# EAGLE design MC33932_H-Bridge (EAGLE 8.6.3)
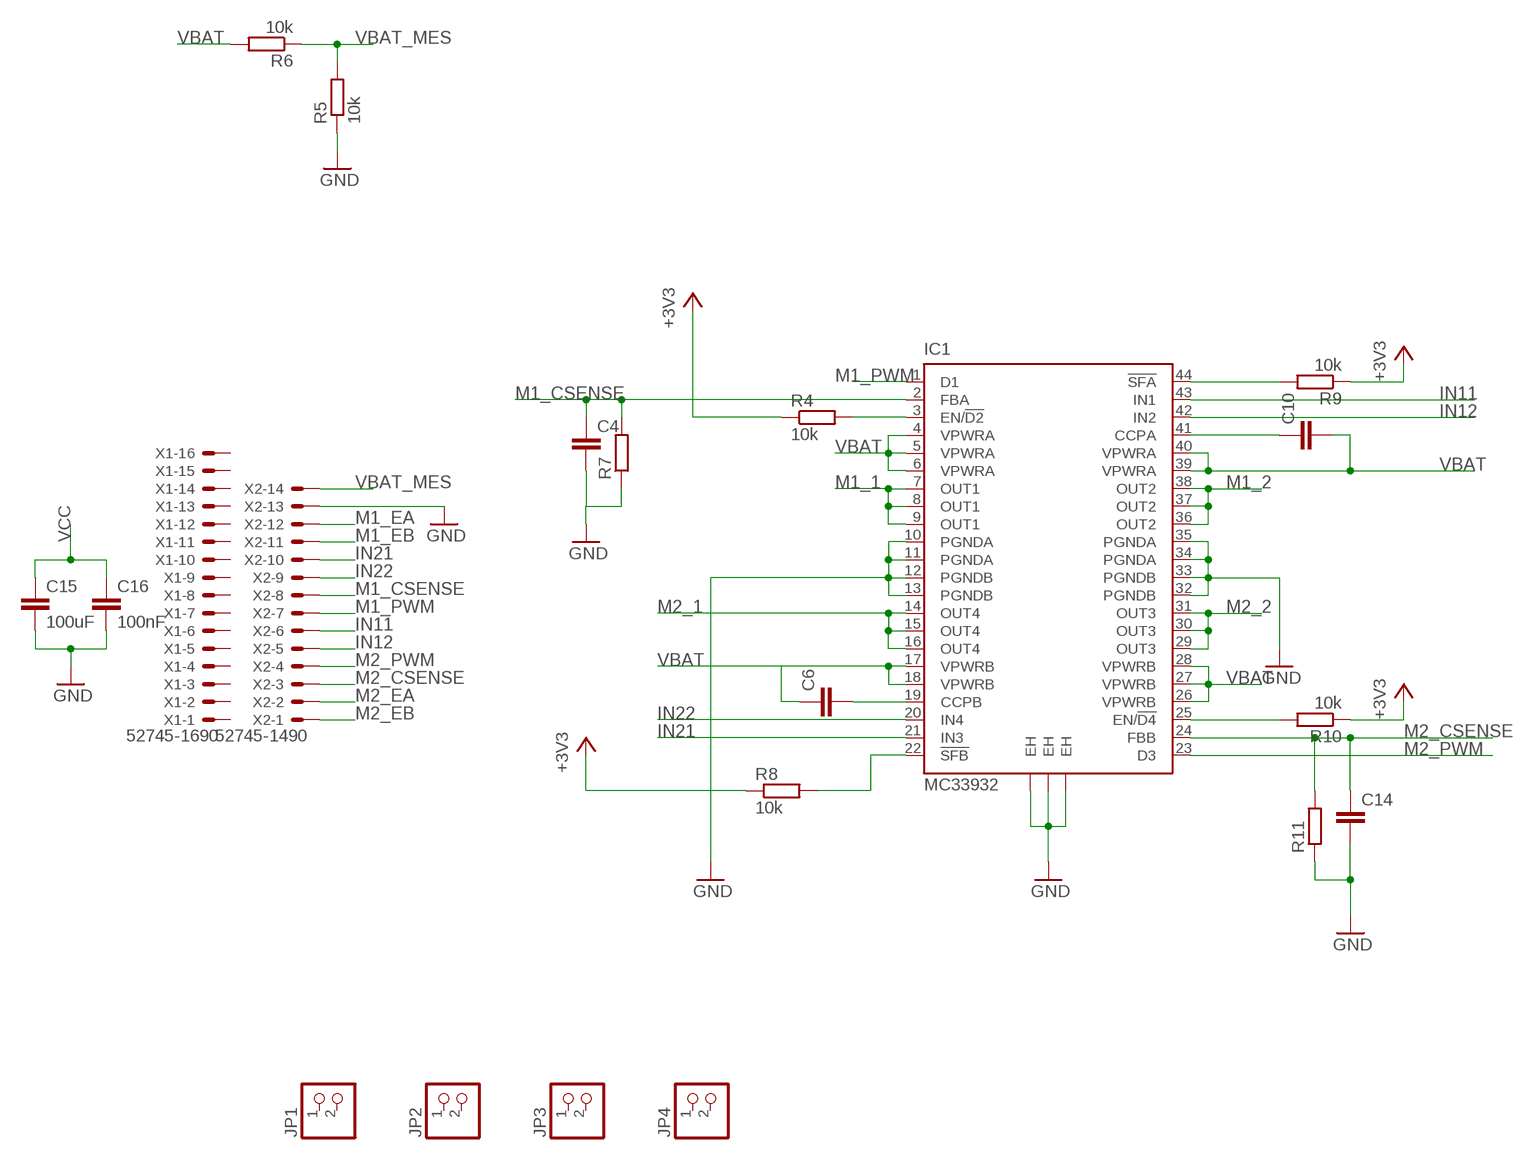
[diagram p0: schematic, sheet 1]

## Parts
C4  C-EUC0603  [C0603]
C6  C-EUC0805  [C0805]
C10  C-EUC0805  [C0805]
C14  C-EUC0603  [C0603]
C15  100uF  C-EUC1210K  [C1210K]
C16  100nF  C-EUC0603  [C0603]
IC1  MC33932  [HSOP44]
JP1  PINHD-1X2  [1X02]
JP2  PINHD-1X2  [1X02]
JP3  PINHD-1X2  [1X02]
JP4  PINHD-1X2  [1X02]
R4  10k  R-EU_R0603  [R0603]
R5  10k  R-EU_R0603  [R0603]
R6  10k  R-EU_R0603  [R0603]
R7  R-EU_R0603  [R0603]
R8  10k  R-EU_R0603  [R0603]
R9  10k  R-EU_R0603  [R0603]
R10  10k  R-EU_R0603  [R0603]
R11  R-EU_R0603  [R0603]
X1  52745-1690  [52745-1690]
X2  52745-1490  [52745-1490]

## Nets
+3V3: R4.1 R8.1 R9.1 R10.1
GND: C4.2 C14.2 C15.2 C16.2 IC1.10(PGNDA) IC1.11(PGNDA) IC1.12(PGNDB) IC1.13(PGNDB) IC1.32(PGNDB) IC1.33(PGNDB) IC1.34(PGNDA) IC1.35(PGNDA) IC1.EH@1(EH) IC1.EH@2(EH) IC1.EH@3(EH) R5.1 R7.1 R11.1 X2.13
IN11: IC1.43(IN1) X2.6
IN12: IC1.42(IN2) X2.5
IN21: IC1.21(IN3) X2.10
IN22: IC1.20(IN4) X2.9
M1_1: IC1.7(OUT1) IC1.8(OUT1) IC1.9(OUT1)
M1_2: IC1.36(OUT2) IC1.37(OUT2) IC1.38(OUT2)
M1_CSENSE: C4.1 IC1.2(FBA) R7.2 X2.8
M1_EA: X2.12
M1_EB: X2.11
M1_PWM: IC1.1(D1) X2.7
M2_1: IC1.14(OUT4) IC1.15(OUT4) IC1.16(OUT4)
M2_2: IC1.29(OUT3) IC1.30(OUT3) IC1.31(OUT3)
M2_CSENSE: C14.1 IC1.24(FBB) R11.2 X2.3
M2_EA: X2.2
M2_EB: X2.1
M2_PWM: IC1.23(D3) X2.4
N$3: C10.1 IC1.41(CCPA)
N$8: IC1.3(EN/!D2) R4.2
N$9: C6.2 IC1.19(CCPB)
N$11: IC1.22(!SFB) R8.2
N$12: IC1.25(EN/!D4) R10.2
N$13: IC1.44(!SFA) R9.2
VBAT: C6.1 C10.2 IC1.4(VPWRA) IC1.5(VPWRA) IC1.6(VPWRA) IC1.17(VPWRB) IC1.18(VPWRB) IC1.26(VPWRB) IC1.27(VPWRB) IC1.28(VPWRB) IC1.39(VPWRA) IC1.40(VPWRA) R6.2
VBAT_MES: R5.2 R6.1 X2.14
VCC: C15.1 C16.1
Unconnected: JP1.1 JP1.2 JP2.1 JP2.2 JP3.1 JP3.2 JP4.1 JP4.2 X1.1 X1.2 X1.3 X1.4 X1.5 X1.6 X1.7 X1.8 X1.9 X1.10 X1.11 X1.12 X1.13 X1.14 X1.15 X1.16

## Library data of the parts
C4 C6 C10 C14-C16 = rcl:C-EU: CAPACITOR, European symbol; SPICEPREFIX: C
IC1 = freescale:MC33932: 5.0 A Throttle Control H-Bridge Auto generated by make-symbol-device-package-bsdl.ulp Rev. 33 Source: http://www.freescale.com/files/analog/doc/data_sheet/MC33932.pdf?fpsp=1; MPN: MC33932VW; OC_FARNELL: 1701639; OC_NEWARK: 67P3304
JP1-JP4 = pinhead:PINHD-1X2: PIN HEADER
R4-R11 = rcl:R-EU_: RESISTOR, European symbol; SPICEPREFIX: R
X1 = con-molex:52745-1690: FFC/FPC-to-Board 0.50mm (.020") SMT Top Contact Right Angle, ZIF, Style Receptacle 52745 / 52435 Source: http://www.molex.com/product/ffc/52745.html; MF: MOLEX; MPN: 52745-1690; OC_FARNELL: unknown; OC_NEWARK: 57H4224
X2 = con-molex:52745-1490: FFC/FPC-to-Board 0.50mm (.020") SMT Top Contact Right Angle, ZIF, Style Receptacle 52745 / 52435 Source: http://www.molex.com/product/ffc/52745.html; MF: WALDOM/MOLEX; MPN: 52745-1490; OC_FARNELL: unknown; OC_NEWARK: 38C9888

## Board
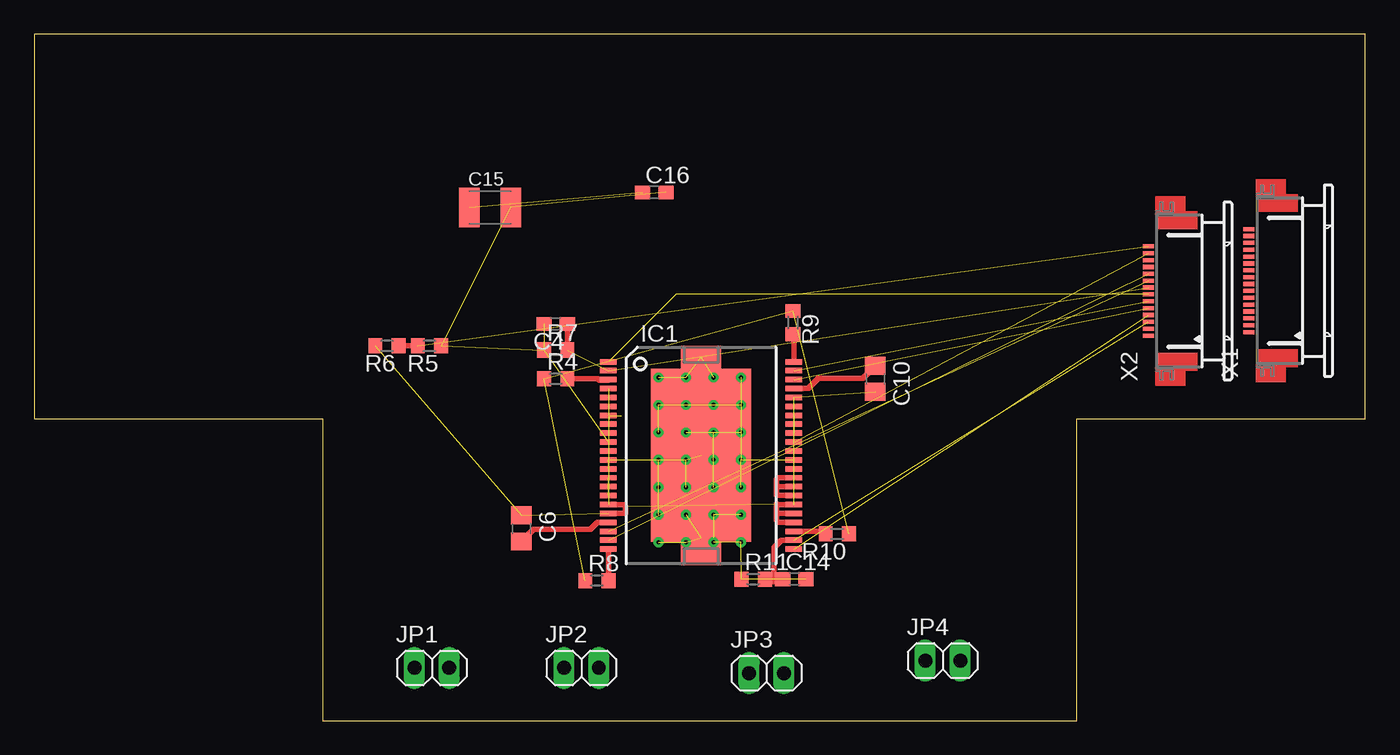
[diagram p1: board, top side]

Size 97 x 50 mm. Coordinates in mm from the lower left corner, seen from the top.
Outline: 21,0 76,0 76,22 97,22 97,50 0,50 0,22 21,22 21,0
Copper layers (1*16): Top 0.035mm / dielectric 1.5mm / Bottom 0.035mm
Design rules "default *": minimum track width 6mil, minimum drill 0.3mm, track to track 6mil, track to pad 6mil, pad to pad 6mil, via to via 6mil, smd to smd 6mil, copper to edge 40mil, drill to drill 6mil, minimum pad ring 10mil, minimum via ring 8mil, stop-mask expansion 4mil, vias tented up to drill 50mil, thermal gap 10mil

### Footprints (pad centres in the part's own frame; a part is rotated, then mirrored left to right if it is on the bottom)
C0603 = smd 1.1 x 1: 1 -0.85,0; 2 0.85,0
C0805 = smd 1.3 x 1.5: 1 -0.95,0; 2 0.95,0
C1210K = smd 1.5 x 2.9: 1 -1.5,0; 2 1.5,0
HSOP44 = smd 0.4 x 1.2: 1 -6.825,-6.75; 2 -6.175,-6.75; 3 -5.525,-6.75; 4 -4.875,-6.75; 5 -4.225,-6.75; 6 -3.575,-6.75; 7 -2.925,-6.75; 8 -2.275,-6.75; 9 -1.625,-6.75; 10 -0.975,-6.75; 11 -0.325,-6.75; 12 0.325,-6.75; 13 0.975,-6.75; 14 1.625,-6.75; 15 2.275,-6.75; 16 2.925,-6.75; 17 3.575,-6.75; 18 4.225,-6.75; 19 4.875,-6.75; 20 5.525,-6.75; 21 6.175,-6.75; 22 6.825,-6.75; 23 6.825,6.75; 24 6.175,6.75; 25 5.525,6.75; 26 4.875,6.75; 27 4.225,6.75; 28 3.575,6.75; 29 2.925,6.75; 30 2.275,6.75; 31 1.625,6.75; 32 0.975,6.75; 33 0.325,6.75; 34 -0.325,6.75; 35 -0.975,6.75; 36 -1.625,6.75; 37 -2.275,6.75; 38 -2.925,6.75; 39 -3.575,6.75; 40 -4.225,6.75; 41 -4.875,6.75; 42 -5.525,6.75; 43 -6.175,6.75; 44 -6.825,6.75 | smd 12.6 x 7.3: EH@1 0,0 | smd 1.7 x 2.9: EH@2 -7.15,0; EH@3 7.15,0
1X02 = drill 1.016 long: 1 -1.27,0; 2 1.27,0
R0603 = smd 1 x 1.1: 1 -0.85,0; 2 0.85,0
52745-1690 = smd 0.3 x 0.8: 1 -3.75,2.5; 2 -3.25,2.5; 3 -2.75,2.5; 4 -2.25,2.5; 5 -1.75,2.5; 6 -1.25,2.5; 7 -0.75,2.5; 8 -0.25,2.5; 9 0.25,2.5; 10 0.75,2.5; 11 1.25,2.5; 12 1.75,2.5; 13 2.25,2.5; 14 2.75,2.5; 15 3.25,2.5; 16 3.75,2.5
52745-1490 = smd 0.3 x 0.8: 1 -3.25,2.5; 2 -2.75,2.5; 3 -2.25,2.5; 4 -1.75,2.5; 5 -1.25,2.5; 6 -0.75,2.5; 7 -0.25,2.5; 8 0.25,2.5; 9 0.75,2.5; 10 1.25,2.5; 11 1.75,2.5; 12 2.25,2.5; 13 2.75,2.5; 14 3.25,2.5

### Placement (x,y rotation side)
C4  38,28.9 180 top
C6  35.5,14 270 top
C10  61.3,24.9 270 top
C14  55.4,10.3 0 top
C15  33.22,37.39 0 top
C16  45.18,38.48 0 top
IC1  48.6,19.32 270 top
JP1  28.98,3.84 0 top
JP2  39.87,3.84 0 top
JP3  53.36,3.45 0 top
JP4  66.21,4.37 0 top
R4  38,24.9 0 top
R5  28.8,27.3 180 top
R6  25.7,27.3 180 top
R7  38,27 0 top
R8  41,10.2 0 top
R9  55.3,29 270 top
R10  58.53,13.6 180 top
R11  52.4,10.3 0 top
X1  91.03,32.05 90 top
X2  83.7,31.3 90 top

### Tracks (layer width: path | path; a pad name or v marks a point on that pad's centre or on a via)
+3V3  (3 unrouted)
GND  (via drill 0.3)  (43 unrouted)
  Top 1.016: v49.5,25 49.5,19.32 IC1.EH@1 49.02,19.32 49.02,13.31 | 49.02,13.31 49.5,13.31 v49.5,13 | IC1.EH@3 48.6,13.31 49.02,13.31
  other vias: 45.5,25 47.5,25 51.5,25 45.5,23 45.5,21 45.5,19 45.5,17 45.5,15 45.5,13 47.5,13 51.5,13 51.5,15 51.5,17 51.5,19 51.5,21 51.5,23 47.5,19 49.5,19 47.5,21 49.5,21 47.5,17 49.5,17 49.5,15 47.5,15 47.5,23 49.5,23
IN11  (1 unrouted)
IN12  (1 unrouted)
IN21  (1 unrouted)
IN22  (1 unrouted)
M1_1  (3 unrouted)
  Top 0.406: IC1.7 41.89,22.2
M1_2  (2 unrouted)
M1_CSENSE  (2 unrouted)
  Top 0.406: R7.2 C4.1
M1_PWM  (2 unrouted)
M2_1  (2 unrouted)
M2_2
  Top 0.406: IC1.31 54.19,17.69 54.1,17.6 54.1,17 | 54.1,17 54.1,16.4 IC1.29 | IC1.30 54.14,17.04 54.1,17
M2_CSENSE  (1 unrouted)
  Top 0.406: IC1.24 54.44,13.14 53.9,12.6 53.9,10.1 53.45,10.1 R11.2 C14.1
M2_PWM  (1 unrouted)
N$3
  Top 0.406: IC1.41 55.96,24.19 55.99,24.22 56.42,24.22 57.16,24.96 60.41,24.96 C10.1
N$8
  Top 0.406: R4.2 41.1,24.9 41.2,24.8 41.81,24.8 IC1.3
N$9
  Top 0.406: C6.2 36.39,13.94 40.55,13.94 41.04,14.44 IC1.19
N$11
  Top 0.406: IC1.22 R8.2
N$12
  Top 0.406: IC1.25 57.74,13.79 R10.2
N$13
  Top 0.406: IC1.44 55.35,28.1 R9.2
VBAT  (9 unrouted)
  Top 0.406: IC1.17 42.96,15.74 43.1,15.6 43.1,15.1 43.09,15.09 IC1.18 | IC1.28 54.16,15.74 54.1,15.8 54.1,15.2 | 54.1,15.2 54.1,14.6 54.26,14.44 IC1.26 | IC1.27 54.21,15.09 54.1,15.2 | 24.69,27.46 R6.2
VBAT_MES  (1 unrouted)
  Top 0.406: R6.1 R5.2
VCC  (1 unrouted)